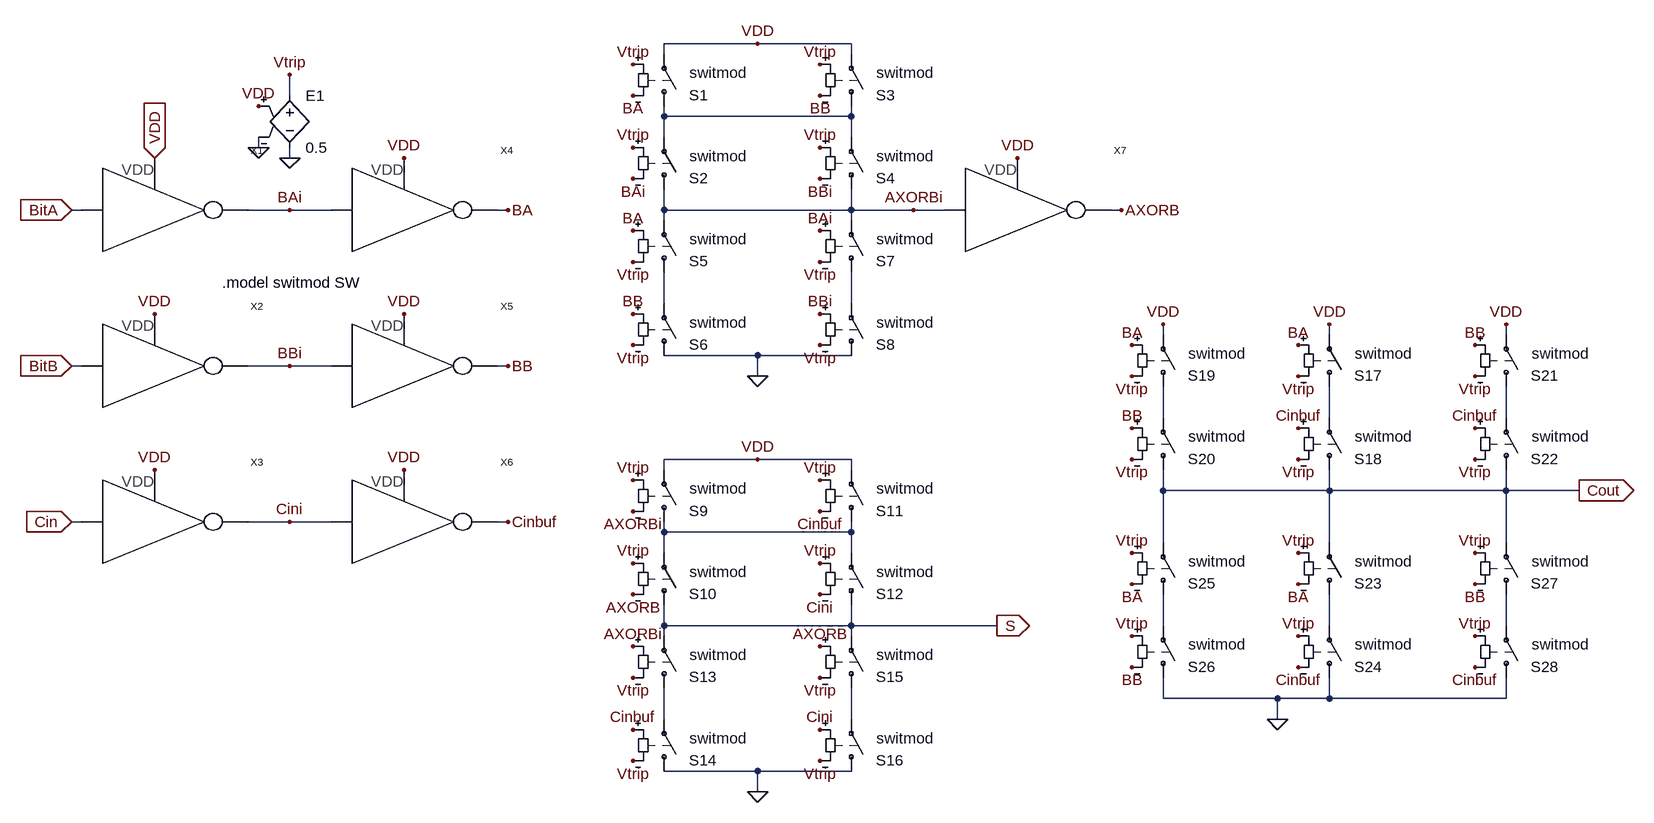
[diagram p0: schematic Adderbit.asc]
Adderbit.asc, the LTspice schematic file:
Version 4
SHEET 1 6308 700
WIRE 2960 -896 2816 -896
WIRE 3104 -896 2960 -896
WIRE 2816 -880 2816 -896
WIRE 3104 -880 3104 -896
WIRE 2240 -816 2240 -848
WIRE 2816 -784 2816 -800
WIRE 3104 -784 3104 -800
WIRE 3104 -784 2816 -784
WIRE 2816 -752 2816 -784
WIRE 3104 -752 3104 -784
WIRE 2192 -736 2192 -752
WIRE 2240 -720 2240 -736
WIRE 1920 -640 1904 -640
WIRE 2240 -640 2176 -640
WIRE 2304 -640 2240 -640
WIRE 2576 -640 2560 -640
WIRE 2816 -640 2816 -672
WIRE 3104 -640 3104 -672
WIRE 3104 -640 2816 -640
WIRE 3200 -640 3104 -640
WIRE 3248 -640 3200 -640
WIRE 3520 -640 3504 -640
WIRE 2816 -624 2816 -640
WIRE 3104 -624 3104 -640
WIRE 2816 -496 2816 -544
WIRE 3104 -496 3104 -544
WIRE 3584 -448 3584 -464
WIRE 3840 -448 3840 -464
WIRE 4112 -448 4112 -464
WIRE 2960 -416 2816 -416
WIRE 3104 -416 2960 -416
WIRE 1920 -400 1904 -400
WIRE 2240 -400 2176 -400
WIRE 2304 -400 2240 -400
WIRE 2576 -400 2560 -400
WIRE 2960 -384 2960 -416
WIRE 3584 -320 3584 -368
WIRE 3840 -320 3840 -368
WIRE 4112 -320 4112 -368
WIRE 2960 -256 2816 -256
WIRE 3104 -256 2960 -256
WIRE 2816 -240 2816 -256
WIRE 3104 -240 3104 -256
WIRE 3584 -208 3584 -240
WIRE 3840 -208 3840 -240
WIRE 3840 -208 3584 -208
WIRE 4112 -208 4112 -240
WIRE 4112 -208 3840 -208
WIRE 4224 -208 4112 -208
WIRE 1920 -160 1904 -160
WIRE 2240 -160 2176 -160
WIRE 2304 -160 2240 -160
WIRE 2576 -160 2560 -160
WIRE 2816 -144 2816 -160
WIRE 3104 -144 3104 -160
WIRE 3104 -144 2816 -144
WIRE 3584 -128 3584 -208
WIRE 3840 -128 3840 -208
WIRE 4112 -128 4112 -208
WIRE 2816 -112 2816 -144
WIRE 3104 -112 3104 -144
WIRE 2816 0 2816 -32
WIRE 3104 0 3104 -32
WIRE 3104 0 2816 0
WIRE 3328 0 3104 0
WIRE 3584 0 3584 -48
WIRE 3840 0 3840 -48
WIRE 4112 0 4112 -48
WIRE 2816 16 2816 0
WIRE 3104 16 3104 0
WIRE 3584 112 3584 80
WIRE 3760 112 3584 112
WIRE 3840 112 3840 80
WIRE 3840 112 3760 112
WIRE 4112 112 4112 80
WIRE 4112 112 3840 112
WIRE 2816 144 2816 96
WIRE 3104 144 3104 96
WIRE 3760 144 3760 112
WIRE 2960 224 2816 224
WIRE 3104 224 2960 224
WIRE 2960 256 2960 224
FLAG 1904 -640 BitA
IOPIN 1904 -640 In
FLAG 2032 -720 VDD
IOPIN 2032 -720 In
FLAG 1904 -400 BitB
IOPIN 1904 -400 In
FLAG 2032 -480 VDD
FLAG 1904 -160 Cin
IOPIN 1904 -160 In
FLAG 2032 -240 VDD
FLAG 2416 -720 VDD
FLAG 2416 -480 VDD
FLAG 2416 -240 VDD
FLAG 2240 -640 BAi
FLAG 2576 -640 BA
FLAG 2240 -400 BBi
FLAG 2240 -160 Cini
FLAG 2576 -400 BB
FLAG 2576 -160 Cinbuf
FLAG 2240 -720 0
FLAG 2192 -736 0
FLAG 2192 -800 VDD
FLAG 2240 -848 Vtrip
FLAG 2960 -384 0
FLAG 2960 -896 VDD
FLAG 3200 -640 AXORBi
FLAG 2768 -864 Vtrip
FLAG 3056 -864 Vtrip
FLAG 3056 -736 Vtrip
FLAG 2768 -736 Vtrip
FLAG 2768 -816 BA
FLAG 2768 -608 BA
FLAG 3056 -816 BB
FLAG 2768 -480 BB
FLAG 2768 -688 BAi
FLAG 3056 -608 BAi
FLAG 3056 -480 BBi
FLAG 3056 -688 BBi
FLAG 2768 -560 Vtrip
FLAG 2768 -432 Vtrip
FLAG 3056 -560 Vtrip
FLAG 3056 -432 Vtrip
FLAG 4224 -208 Cout
IOPIN 4224 -208 Out
FLAG 3328 0 S
IOPIN 3328 0 Out
FLAG 3360 -720 VDD
FLAG 2960 256 0
FLAG 2960 -256 VDD
FLAG 2768 -224 Vtrip
FLAG 3056 -224 Vtrip
FLAG 3056 -96 Vtrip
FLAG 2768 -96 Vtrip
FLAG 2768 -176 AXORBi
FLAG 2768 32 AXORBi
FLAG 3056 -176 Cinbuf
FLAG 2768 160 Cinbuf
FLAG 2768 -48 AXORB
FLAG 3056 32 AXORB
FLAG 3056 160 Cini
FLAG 3056 -48 Cini
FLAG 2768 80 Vtrip
FLAG 2768 208 Vtrip
FLAG 3056 80 Vtrip
FLAG 3056 208 Vtrip
FLAG 3520 -640 AXORB
FLAG 3840 -464 VDD
FLAG 3584 -464 VDD
FLAG 4112 -464 VDD
FLAG 3536 -384 Vtrip
FLAG 3792 -384 Vtrip
FLAG 4064 -384 Vtrip
FLAG 3536 -256 Vtrip
FLAG 3792 -256 Vtrip
FLAG 4064 -256 Vtrip
FLAG 3536 -432 BA
FLAG 3792 -432 BA
FLAG 3536 -304 BB
FLAG 3792 -304 Cinbuf
FLAG 4064 -304 Cinbuf
FLAG 4064 -432 BB
FLAG 3760 144 0
FLAG 3536 -112 Vtrip
FLAG 3792 -112 Vtrip
FLAG 4064 -112 Vtrip
FLAG 3536 16 Vtrip
FLAG 3792 16 Vtrip
FLAG 4064 16 Vtrip
FLAG 3536 -64 BA
FLAG 3792 -64 BA
FLAG 3536 64 BB
FLAG 4064 -64 BB
FLAG 3792 64 Cinbuf
FLAG 4064 64 Cinbuf
SYMBOL Ideal_inverter 1952 -704 R0
SYMATTR InstName X1
SYMBOL Ideal_inverter 1952 -464 R0
SYMATTR InstName X2
SYMBOL Ideal_inverter 1952 -224 R0
SYMATTR InstName X3
SYMBOL Ideal_inverter 2336 -704 R0
SYMATTR InstName X4
SYMBOL Ideal_inverter 2336 -464 R0
SYMATTR InstName X5
SYMBOL Ideal_inverter 2336 -224 R0
SYMATTR InstName X6
SYMBOL sw 2816 -784 M180
WINDOW 3 24 -12 Left 0
WINDOW 38 39 67 Left 0
WINDOW 0 38 33 Left 0
SYMATTR Value ""
SYMATTR SpiceModel switmod
SYMATTR InstName S1
SYMBOL sw 2816 -656 M180
WINDOW 3 24 -12 Left 0
WINDOW 38 39 67 Left 0
WINDOW 0 38 33 Left 0
SYMATTR Value ""
SYMATTR SpiceModel switmod
SYMATTR InstName S2
SYMBOL e 2240 -832 R0
SYMATTR InstName E1
SYMATTR Value 0.5
SYMBOL sw 3104 -784 M180
WINDOW 3 24 -12 Left 0
WINDOW 38 39 67 Left 0
WINDOW 0 38 33 Left 0
SYMATTR Value ""
SYMATTR SpiceModel switmod
SYMATTR InstName S3
SYMBOL sw 3104 -656 M180
WINDOW 3 24 -12 Left 0
WINDOW 38 39 67 Left 0
WINDOW 0 38 33 Left 0
SYMATTR Value ""
SYMATTR SpiceModel switmod
SYMATTR InstName S4
SYMBOL sw 2816 -528 M180
WINDOW 3 24 -12 Left 0
WINDOW 38 39 67 Left 0
WINDOW 0 38 33 Left 0
SYMATTR Value ""
SYMATTR SpiceModel switmod
SYMATTR InstName S5
SYMBOL sw 2816 -400 M180
WINDOW 3 24 -12 Left 0
WINDOW 38 39 67 Left 0
WINDOW 0 38 33 Left 0
SYMATTR Value ""
SYMATTR SpiceModel switmod
SYMATTR InstName S6
SYMBOL sw 3104 -528 M180
WINDOW 3 24 -12 Left 0
WINDOW 38 39 67 Left 0
WINDOW 0 38 33 Left 0
SYMATTR Value ""
SYMATTR SpiceModel switmod
SYMATTR InstName S7
SYMBOL sw 3104 -400 M180
WINDOW 3 24 -12 Left 0
WINDOW 38 39 67 Left 0
WINDOW 0 38 33 Left 0
SYMATTR Value ""
SYMATTR SpiceModel switmod
SYMATTR InstName S8
SYMBOL Ideal_inverter 3280 -704 R0
SYMATTR InstName X7
SYMBOL sw 2816 -144 M180
WINDOW 3 24 -12 Left 0
WINDOW 38 39 67 Left 0
WINDOW 0 38 33 Left 0
SYMATTR Value ""
SYMATTR SpiceModel switmod
SYMATTR InstName S9
SYMBOL sw 2816 -16 M180
WINDOW 3 24 -12 Left 0
WINDOW 38 39 67 Left 0
WINDOW 0 38 33 Left 0
SYMATTR Value ""
SYMATTR SpiceModel switmod
SYMATTR InstName S10
SYMBOL sw 3104 -144 M180
WINDOW 3 24 -12 Left 0
WINDOW 38 39 67 Left 0
WINDOW 0 38 33 Left 0
SYMATTR Value ""
SYMATTR SpiceModel switmod
SYMATTR InstName S11
SYMBOL sw 3104 -16 M180
WINDOW 3 24 -12 Left 0
WINDOW 38 39 67 Left 0
WINDOW 0 38 33 Left 0
SYMATTR Value ""
SYMATTR SpiceModel switmod
SYMATTR InstName S12
SYMBOL sw 2816 112 M180
WINDOW 3 24 -12 Left 0
WINDOW 38 39 67 Left 0
WINDOW 0 38 33 Left 0
SYMATTR Value ""
SYMATTR SpiceModel switmod
SYMATTR InstName S13
SYMBOL sw 2816 240 M180
WINDOW 3 24 -12 Left 0
WINDOW 38 39 67 Left 0
WINDOW 0 38 33 Left 0
SYMATTR Value ""
SYMATTR SpiceModel switmod
SYMATTR InstName S14
SYMBOL sw 3104 112 M180
WINDOW 3 24 -12 Left 0
WINDOW 38 39 67 Left 0
WINDOW 0 38 33 Left 0
SYMATTR Value ""
SYMATTR SpiceModel switmod
SYMATTR InstName S15
SYMBOL sw 3104 240 M180
WINDOW 3 24 -12 Left 0
WINDOW 38 39 67 Left 0
WINDOW 0 38 33 Left 0
SYMATTR Value ""
SYMATTR SpiceModel switmod
SYMATTR InstName S16
SYMBOL sw 3840 -352 M180
WINDOW 3 24 -12 Left 0
WINDOW 38 39 67 Left 0
WINDOW 0 38 33 Left 0
SYMATTR Value ""
SYMATTR SpiceModel switmod
SYMATTR InstName S17
SYMBOL sw 3840 -224 M180
WINDOW 3 24 -12 Left 0
WINDOW 38 39 67 Left 0
WINDOW 0 38 33 Left 0
SYMATTR Value ""
SYMATTR SpiceModel switmod
SYMATTR InstName S18
SYMBOL sw 3584 -352 M180
WINDOW 3 24 -12 Left 0
WINDOW 38 39 67 Left 0
WINDOW 0 38 33 Left 0
SYMATTR Value ""
SYMATTR SpiceModel switmod
SYMATTR InstName S19
SYMBOL sw 3584 -224 M180
WINDOW 3 24 -12 Left 0
WINDOW 38 39 67 Left 0
WINDOW 0 38 33 Left 0
SYMATTR Value ""
SYMATTR SpiceModel switmod
SYMATTR InstName S20
SYMBOL sw 4112 -352 M180
WINDOW 3 24 -12 Left 0
WINDOW 38 39 67 Left 0
WINDOW 0 38 33 Left 0
SYMATTR Value ""
SYMATTR SpiceModel switmod
SYMATTR InstName S21
SYMBOL sw 4112 -224 M180
WINDOW 3 24 -12 Left 0
WINDOW 38 39 67 Left 0
WINDOW 0 38 33 Left 0
SYMATTR Value ""
SYMATTR SpiceModel switmod
SYMATTR InstName S22
SYMBOL sw 3840 -32 M180
WINDOW 3 24 -12 Left 0
WINDOW 38 39 67 Left 0
WINDOW 0 38 33 Left 0
SYMATTR Value ""
SYMATTR SpiceModel switmod
SYMATTR InstName S23
SYMBOL sw 3840 96 M180
WINDOW 3 24 -12 Left 0
WINDOW 38 39 67 Left 0
WINDOW 0 38 33 Left 0
SYMATTR Value ""
SYMATTR SpiceModel switmod
SYMATTR InstName S24
SYMBOL sw 3584 -32 M180
WINDOW 3 24 -12 Left 0
WINDOW 38 39 67 Left 0
WINDOW 0 38 33 Left 0
SYMATTR Value ""
SYMATTR SpiceModel switmod
SYMATTR InstName S25
SYMBOL sw 3584 96 M180
WINDOW 3 24 -12 Left 0
WINDOW 38 39 67 Left 0
WINDOW 0 38 33 Left 0
SYMATTR Value ""
SYMATTR SpiceModel switmod
SYMATTR InstName S26
SYMBOL sw 4112 -32 M180
WINDOW 3 24 -12 Left 0
WINDOW 38 39 67 Left 0
WINDOW 0 38 33 Left 0
SYMATTR Value ""
SYMATTR SpiceModel switmod
SYMATTR InstName S27
SYMBOL sw 4112 96 M180
WINDOW 3 24 -12 Left 0
WINDOW 38 39 67 Left 0
WINDOW 0 38 33 Left 0
SYMATTR Value ""
SYMATTR SpiceModel switmod
SYMATTR InstName S28
TEXT 2136 -528 Left 0 !.model switmod SW

The netlist it stands for:
* Adderbit.asc
XX1 BitA BAi VDD Ideal_inverter  ; pins In Out VDD
XX2 BitB BBi VDD Ideal_inverter  ; pins In Out VDD
XX3 Cin Cini VDD Ideal_inverter  ; pins In Out VDD
XX4 BAi BA VDD Ideal_inverter  ; pins In Out VDD
XX5 BBi BB VDD Ideal_inverter  ; pins In Out VDD
XX6 Cini Cinbuf VDD Ideal_inverter  ; pins In Out VDD
S1 N001 VDD Vtrip BA switmod
S2 AXORBi N001 Vtrip BAi switmod
E1 Vtrip 0 VDD 0 0.5
S3 N001 VDD Vtrip BB switmod
S4 AXORBi N001 Vtrip BBi switmod
S5 N002 AXORBi BA Vtrip switmod
S6 0 N002 BB Vtrip switmod
S7 N003 AXORBi BAi Vtrip switmod
S8 0 N003 BBi Vtrip switmod
XX7 AXORBi AXORB VDD Ideal_inverter  ; pins In Out VDD
S9 N007 VDD Vtrip AXORBi switmod
S10 S N007 Vtrip AXORB switmod
S11 N007 VDD Vtrip Cinbuf switmod
S12 S N007 Vtrip Cini switmod
S13 N011 S AXORBi Vtrip switmod
S14 0 N011 Cinbuf Vtrip switmod
S15 N012 S AXORB Vtrip switmod
S16 0 N012 Cini Vtrip switmod
S17 N005 VDD BA Vtrip switmod
S18 Cout N005 Cinbuf Vtrip switmod
S19 N004 VDD BA Vtrip switmod
S20 Cout N004 BB Vtrip switmod
S21 N006 VDD BB Vtrip switmod
S22 Cout N006 Cinbuf Vtrip switmod
S23 N009 Cout Vtrip BA switmod
S24 0 N009 Vtrip Cinbuf switmod
S25 N008 Cout Vtrip BA switmod
S26 0 N008 Vtrip BB switmod
S27 N010 Cout Vtrip BB switmod
S28 0 N010 Vtrip Cinbuf switmod
.model switmod SW
.backanno
.end